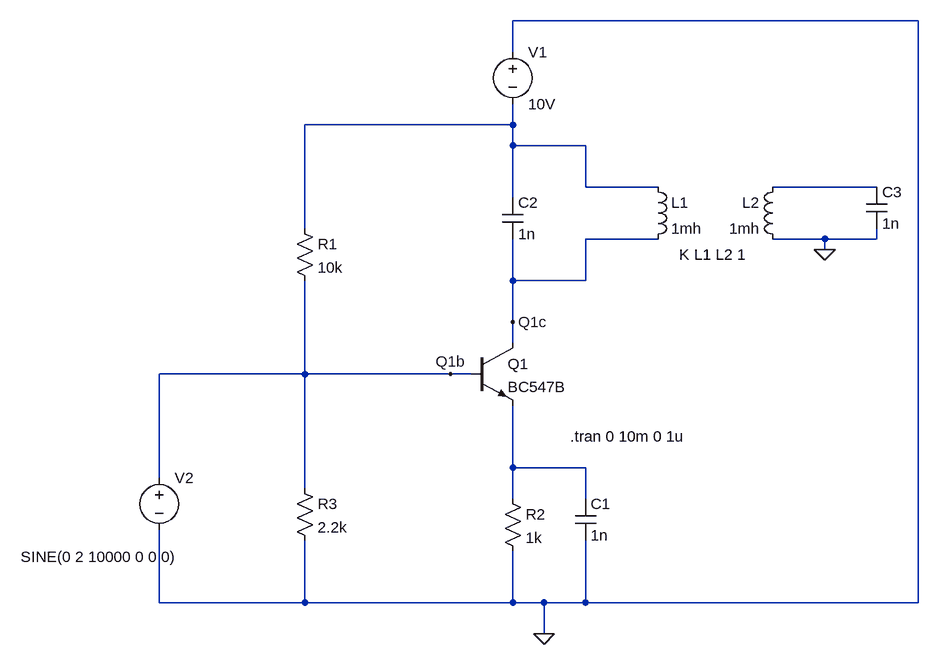
[diagram p0: schematic Double and  stagger  tuned  amp.asc]
Double and  stagger  tuned  amp.asc, the LTspice schematic file:
Version 4.1
SHEET 1 880 724
WIRE 848 -240 224 -240
WIRE 224 -192 224 -240
WIRE 224 -80 224 -112
WIRE 224 -80 -96 -80
WIRE 224 -48 224 -80
WIRE 336 -48 224 -48
WIRE 336 16 336 -48
WIRE 448 16 336 16
WIRE 784 16 624 16
WIRE 224 32 224 -48
WIRE -96 80 -96 -80
WIRE 448 96 336 96
WIRE 704 96 624 96
WIRE 784 96 784 80
WIRE 784 96 704 96
WIRE 704 112 704 96
WIRE 224 160 224 96
WIRE 336 160 336 96
WIRE 336 160 224 160
WIRE 224 224 224 160
WIRE 224 256 224 224
WIRE -96 304 -96 160
WIRE -96 304 -320 304
WIRE 128 304 -96 304
WIRE 160 304 128 304
WIRE 224 448 224 352
WIRE 336 448 224 448
WIRE -320 464 -320 304
WIRE -96 480 -96 304
WIRE 224 496 224 448
WIRE 336 496 336 448
WIRE -320 656 -320 544
WIRE -96 656 -96 560
WIRE -96 656 -320 656
WIRE 224 656 224 576
WIRE 224 656 -96 656
WIRE 272 656 224 656
WIRE 336 656 336 560
WIRE 336 656 272 656
WIRE 848 656 848 -240
WIRE 848 656 336 656
WIRE 272 704 272 656
FLAG 272 704 0
FLAG 224 224 Q1c
FLAG 128 304 Q1b
FLAG 704 112 0
SYMBOL voltage 224 -208 R0
SYMATTR InstName V1
SYMATTR Value 10V
SYMBOL npn 160 256 R0
SYMATTR InstName Q1
SYMATTR Value BC547B
SYMBOL res -112 64 R0
SYMATTR InstName R1
SYMATTR Value 10k
SYMBOL res 208 480 R0
SYMATTR InstName R2
SYMATTR Value 1k
SYMBOL res -112 464 R0
SYMATTR InstName R3
SYMATTR Value 2.2k
SYMBOL cap 320 496 R0
SYMATTR InstName C1
SYMATTR Value 1n
SYMBOL cap 208 32 R0
SYMATTR InstName C2
SYMATTR Value 1n
SYMBOL cap 768 16 R0
SYMATTR InstName C3
SYMATTR Value 1n
SYMBOL ind 432 0 R0
SYMATTR InstName L1
SYMATTR Value 1mh
SYMATTR Type ind
SYMBOL ind 640 0 M0
SYMATTR InstName L2
SYMATTR Value 1mh
SYMATTR Type ind
SYMBOL voltage -320 448 R0
WINDOW 3 -213 137 Left 2
WINDOW 123 0 0 Left 0
WINDOW 39 0 0 Left 0
SYMATTR InstName V2
SYMATTR Value SINE(0 2 10000 0 0 0)
TEXT 480 120 Left 2 !K L1 L2 1
TEXT 312 400 Left 2 !.tran 0 10m 0 1u

The netlist it stands for:
* Double and  stagger  tuned  amp.asc
V1 0 N001 10V
Q1 Q1c Q1b N003 0 BC547B
R1 N001 Q1b 10k
R2 N003 0 1k
R3 Q1b 0 2.2k
C1 N003 0 1n
C2 N001 Q1c 1n
C3 N002 0 1n
L1 N001 Q1c 1mh
L2 N002 0 1mh
V2 Q1b 0 SINE(0 2 10000 0 0 0)
.model NPN NPN
.model PNP PNP
.lib standard.bjt
K L1 L2 1
.tran 0 10m 0 1u
.backanno
.end